# EAGLE schematic CheapSteper (EAGLE 9.6.2)
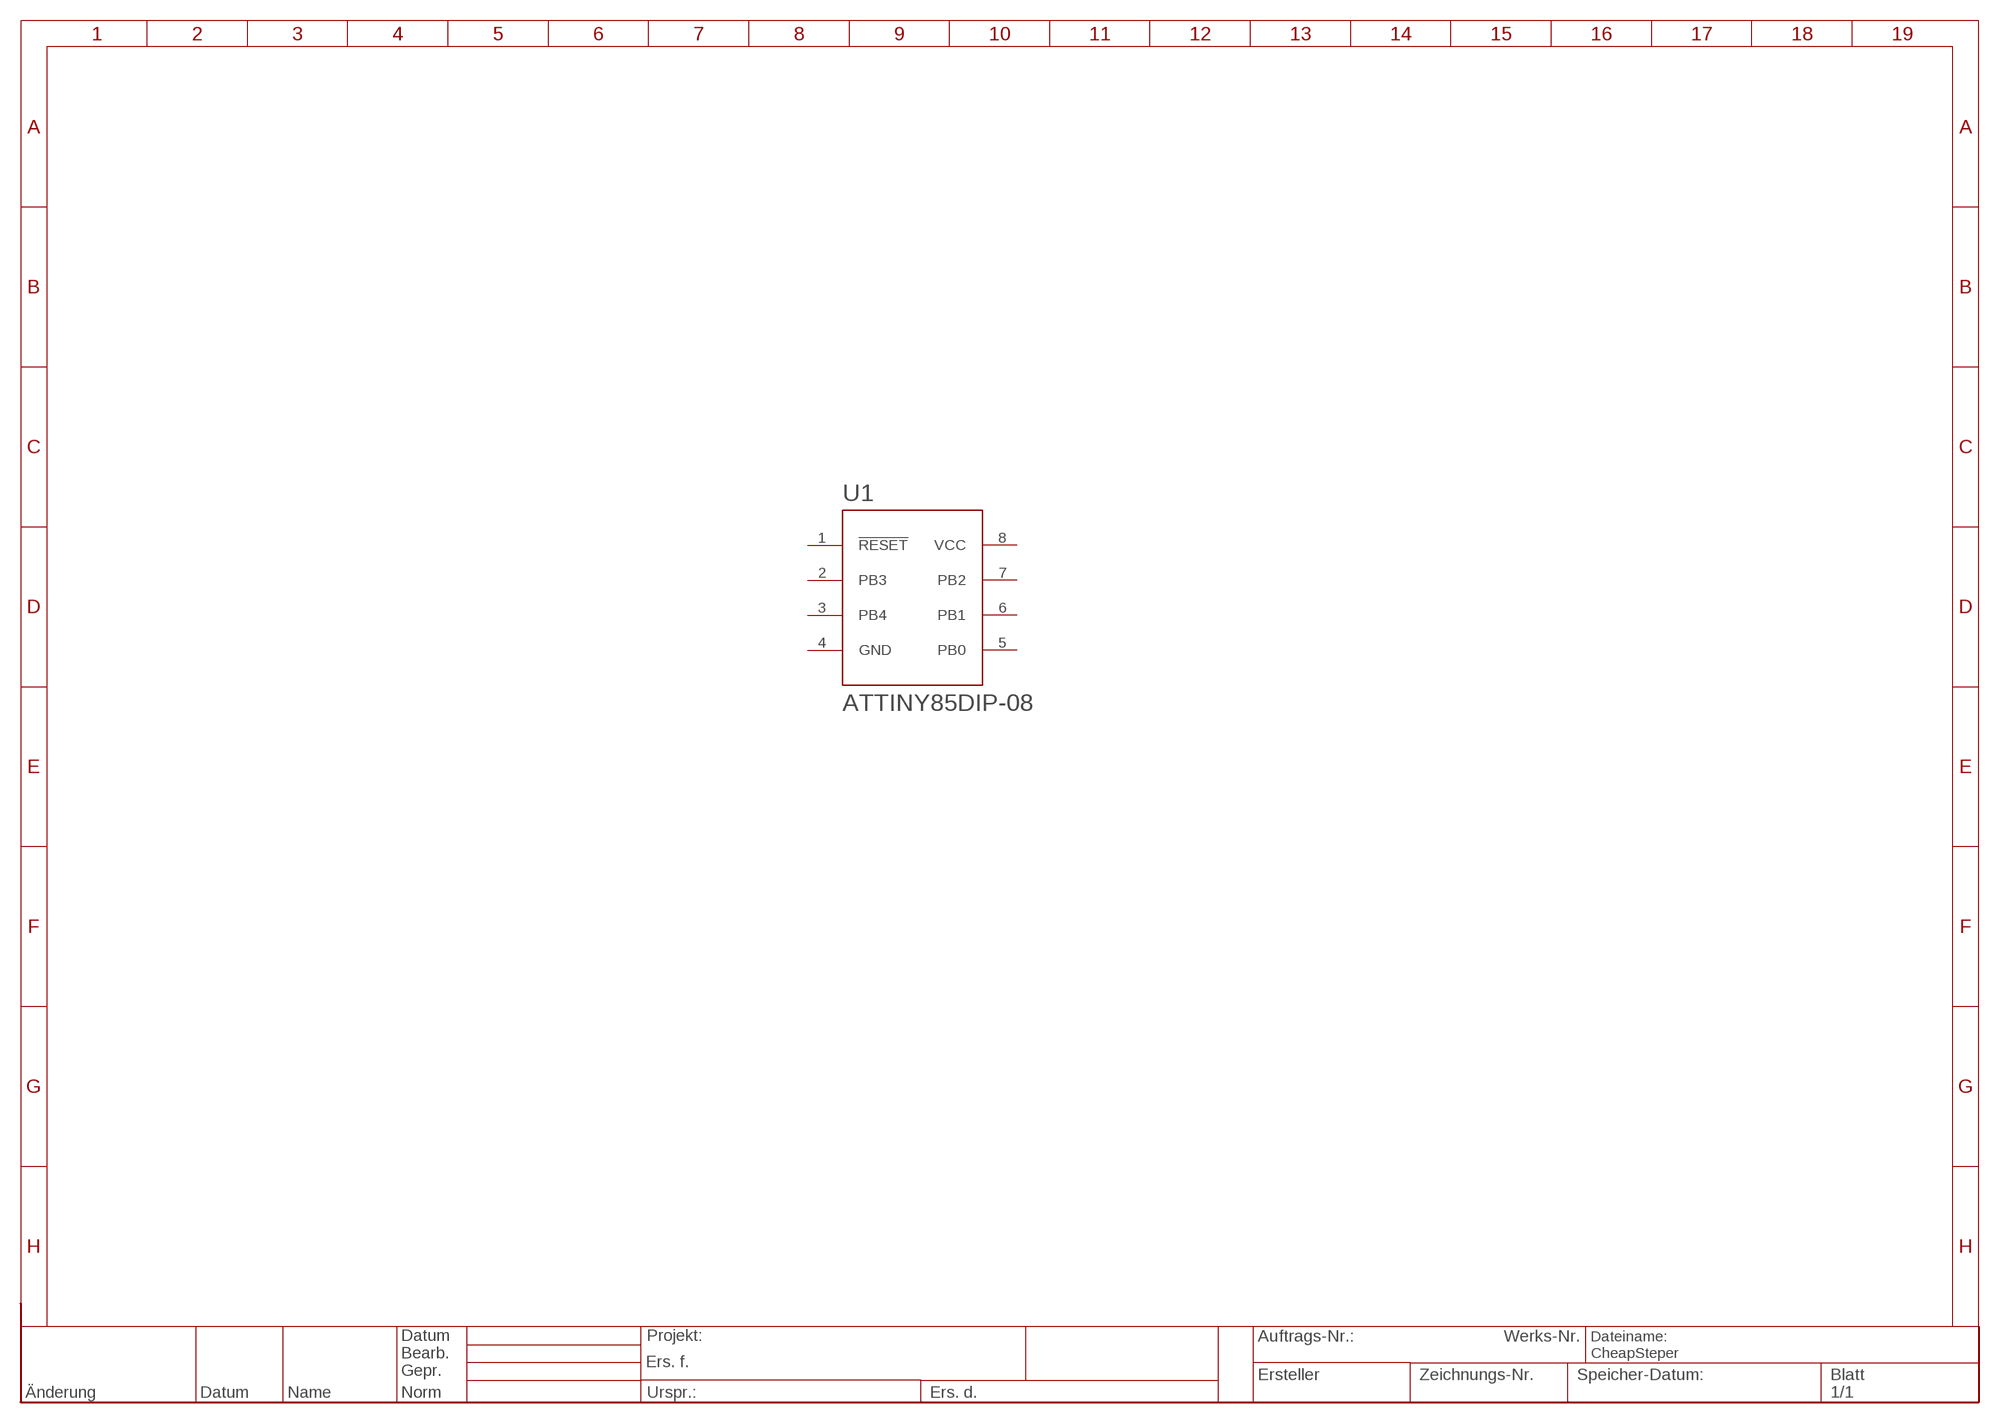
[diagram p0: schematic, sheet 1]

## Parts
U1  ATTINY85DIP-08  [DIP900W57P254L920H431Q8B]
Unconnected: U1.1(!RESET) U1.2(PB3) U1.3(PB4) U1.4(GND) U1.5(PB0) U1.6(PB1) U1.7(PB2) U1.8(VCC)

## Library data of the parts
U1 = Jakobs_LBR:ATTINY85: Atmel 8-bit AVR Microcontroller with 2/4/8K Bytes In-System Programmable Flash Pinout: 1 - (PCINT5/RESET/ADC0/dW) PB5 2 - (PCINT3/XTAL1/CLKI/OC1B/ADC3) PB3 3 - (PCINT4/XTAL2/CLKO/OC1B/ADC2) PB4 4 - GND 5 - PB0 (MOSI/DI/SDA/AIN0/OC0A/OC1A/AREF/PCINT0) 6 - PB1 (MISO/DO/AIN1/OC0B/OC1A/PCINT1) 7 - PB2 (SCK/USCK/SCL/ADC1/T0/INT0/PCINT2) 8 - VCC